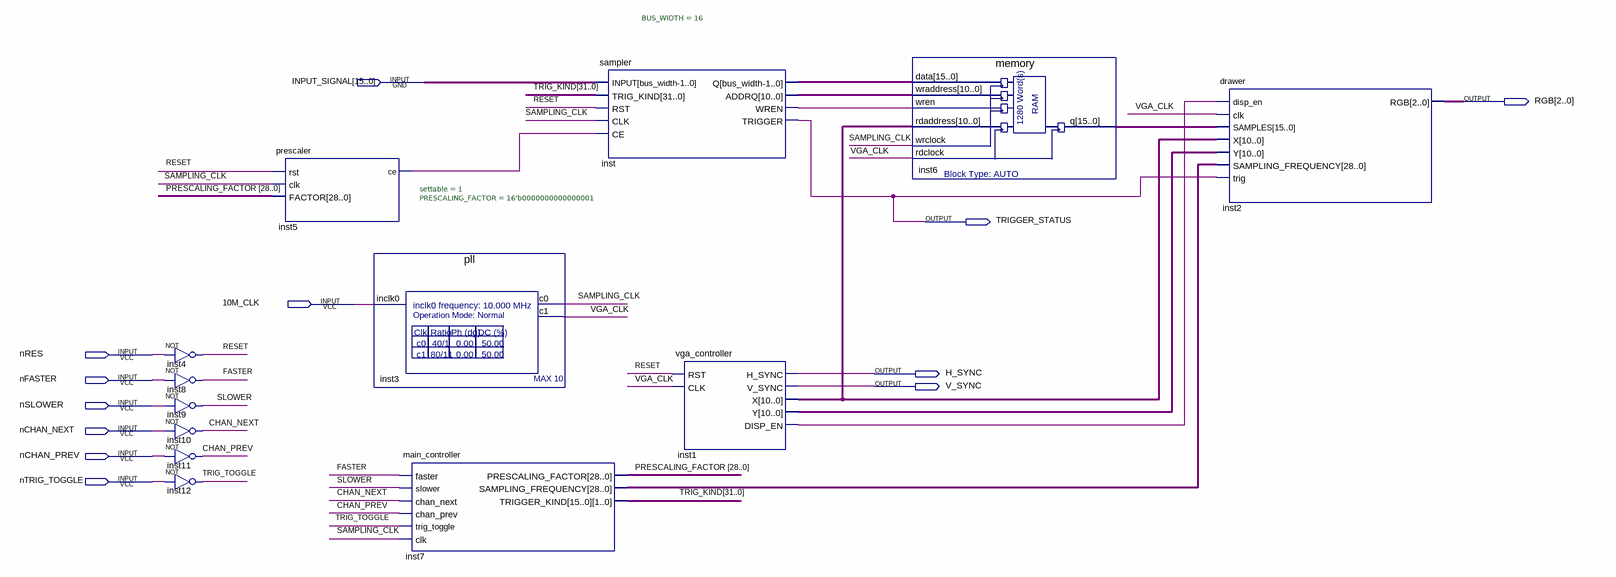
[diagram p0: schematic sheet]
// Quartus schematic logic_analyzer.bdf as structural Verilog: 13 symbols, 12 pins
module logic_analyzer (
  input  [15:0] INPUT_SIGNAL,
  input  \10M_CLK ,
  input  nRES,
  input  nFASTER,
  input  nSLOWER,
  input  nCHAN_NEXT,
  input  nCHAN_PREV,
  input  nTRIG_TOGGLE,
  output [2:0] RGB,
  output TRIGGER_STATUS,
  output H_SYNC,
  output V_SYNC
);

  wire CHAN_NEXT, CHAN_PREV, FASTER, inst1_disp_en, inst5_ce, inst_wren, RESET, SAMPLING_CLK, SLOWER,
       TRIG_TOGGLE, VGA_CLK;
  wire [10:0] inst1_x, inst1_y, inst_addrq;
  wire [15:0] inst6_q, inst_q;
  wire [28:0] inst7_sampling_frequency, PRESCALING_FACTOR;
  wire [31:0] TRIG_KIND;

  not inst4 (RESET, nRES);
  not inst8 (FASTER, nFASTER);
  not inst9 (SLOWER, nSLOWER);
  not inst10 (CHAN_NEXT, nCHAN_NEXT);
  not inst11 (CHAN_PREV, nCHAN_PREV);
  not inst12 (TRIG_TOGGLE, nTRIG_TOGGLE);
  prescaler #(.settable(1), .PRESCALING_FACTOR(16'b0000000000000001)) inst5 (
    .rst(RESET), .clk(SAMPLING_CLK), .FACTOR(PRESCALING_FACTOR), .ce(inst5_ce));
  pll inst3 (.inclk0(\10M_CLK ), .c0(SAMPLING_CLK), .c1(VGA_CLK));
  main_controller inst7 (
    .faster(FASTER), .slower(SLOWER), .chan_next(CHAN_NEXT), .chan_prev(CHAN_PREV),
    .trig_toggle(TRIG_TOGGLE), .clk(SAMPLING_CLK), .PRESCALING_FACTOR(PRESCALING_FACTOR),
    .SAMPLING_FREQUENCY(inst7_sampling_frequency), .TRIGGER_KIND(TRIG_KIND));
  sampler #(.BUS_WIDTH(16)) inst (
    .INPUT(INPUT_SIGNAL), .TRIG_KIND(TRIG_KIND), .RST(RESET), .CLK(SAMPLING_CLK), .CE(inst5_ce), .Q(inst_q),
    .ADDRQ(inst_addrq), .WREN(inst_wren), .TRIGGER(TRIGGER_STATUS));
  vga_controller inst1 (
    .RST(RESET), .CLK(VGA_CLK), .H_SYNC(H_SYNC), .V_SYNC(V_SYNC), .X(inst1_x), .Y(inst1_y),
    .DISP_EN(inst1_disp_en));
  memory inst6 (
    .data(inst_q), .wraddress(inst_addrq), .wren(inst_wren), .rdaddress(inst1_x), .wrclock(SAMPLING_CLK),
    .rdclock(VGA_CLK), .q(inst6_q));
  drawer inst2 (
    .disp_en(inst1_disp_en), .clk(VGA_CLK), .SAMPLES(inst6_q), .X(inst1_x), .Y(inst1_y),
    .SAMPLING_FREQUENCY(inst7_sampling_frequency), .trig(TRIGGER_STATUS), .RGB(RGB));
endmodule
